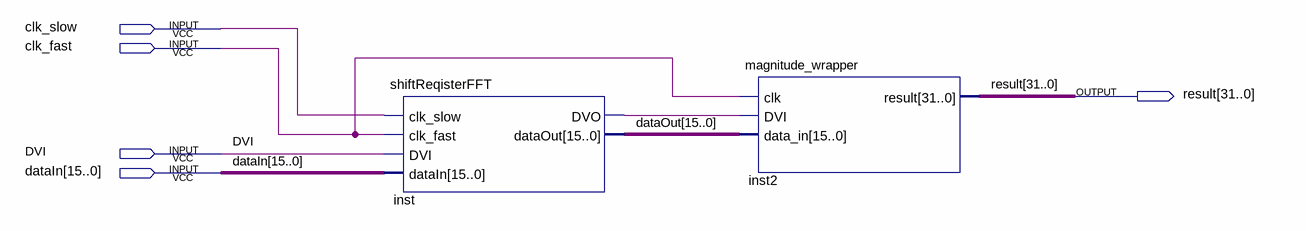
[diagram p0: schematic sheet]
// Quartus schematic projectDesign.bdf as structural Verilog: 2 symbols, 5 pins
module projectDesign (
  input  clk_slow,
  input  clk_fast,
  input  DVI,
  input  [15:0] dataIn,
  output [31:0] result
);

  wire inst_dvo;
  wire [15:0] dataOut;

  shiftReqisterFFT inst (
    .clk_slow(clk_slow), .clk_fast(clk_fast), .DVI(DVI), .dataIn(dataIn), .DVO(inst_dvo), .dataOut(dataOut));
  magnitude_wrapper inst2 (.clk(clk_fast), .DVI(inst_dvo), .data_in(dataOut), .result(result));
endmodule
